# Altium schematic sheet 10ethernet100.SchDoc
size C
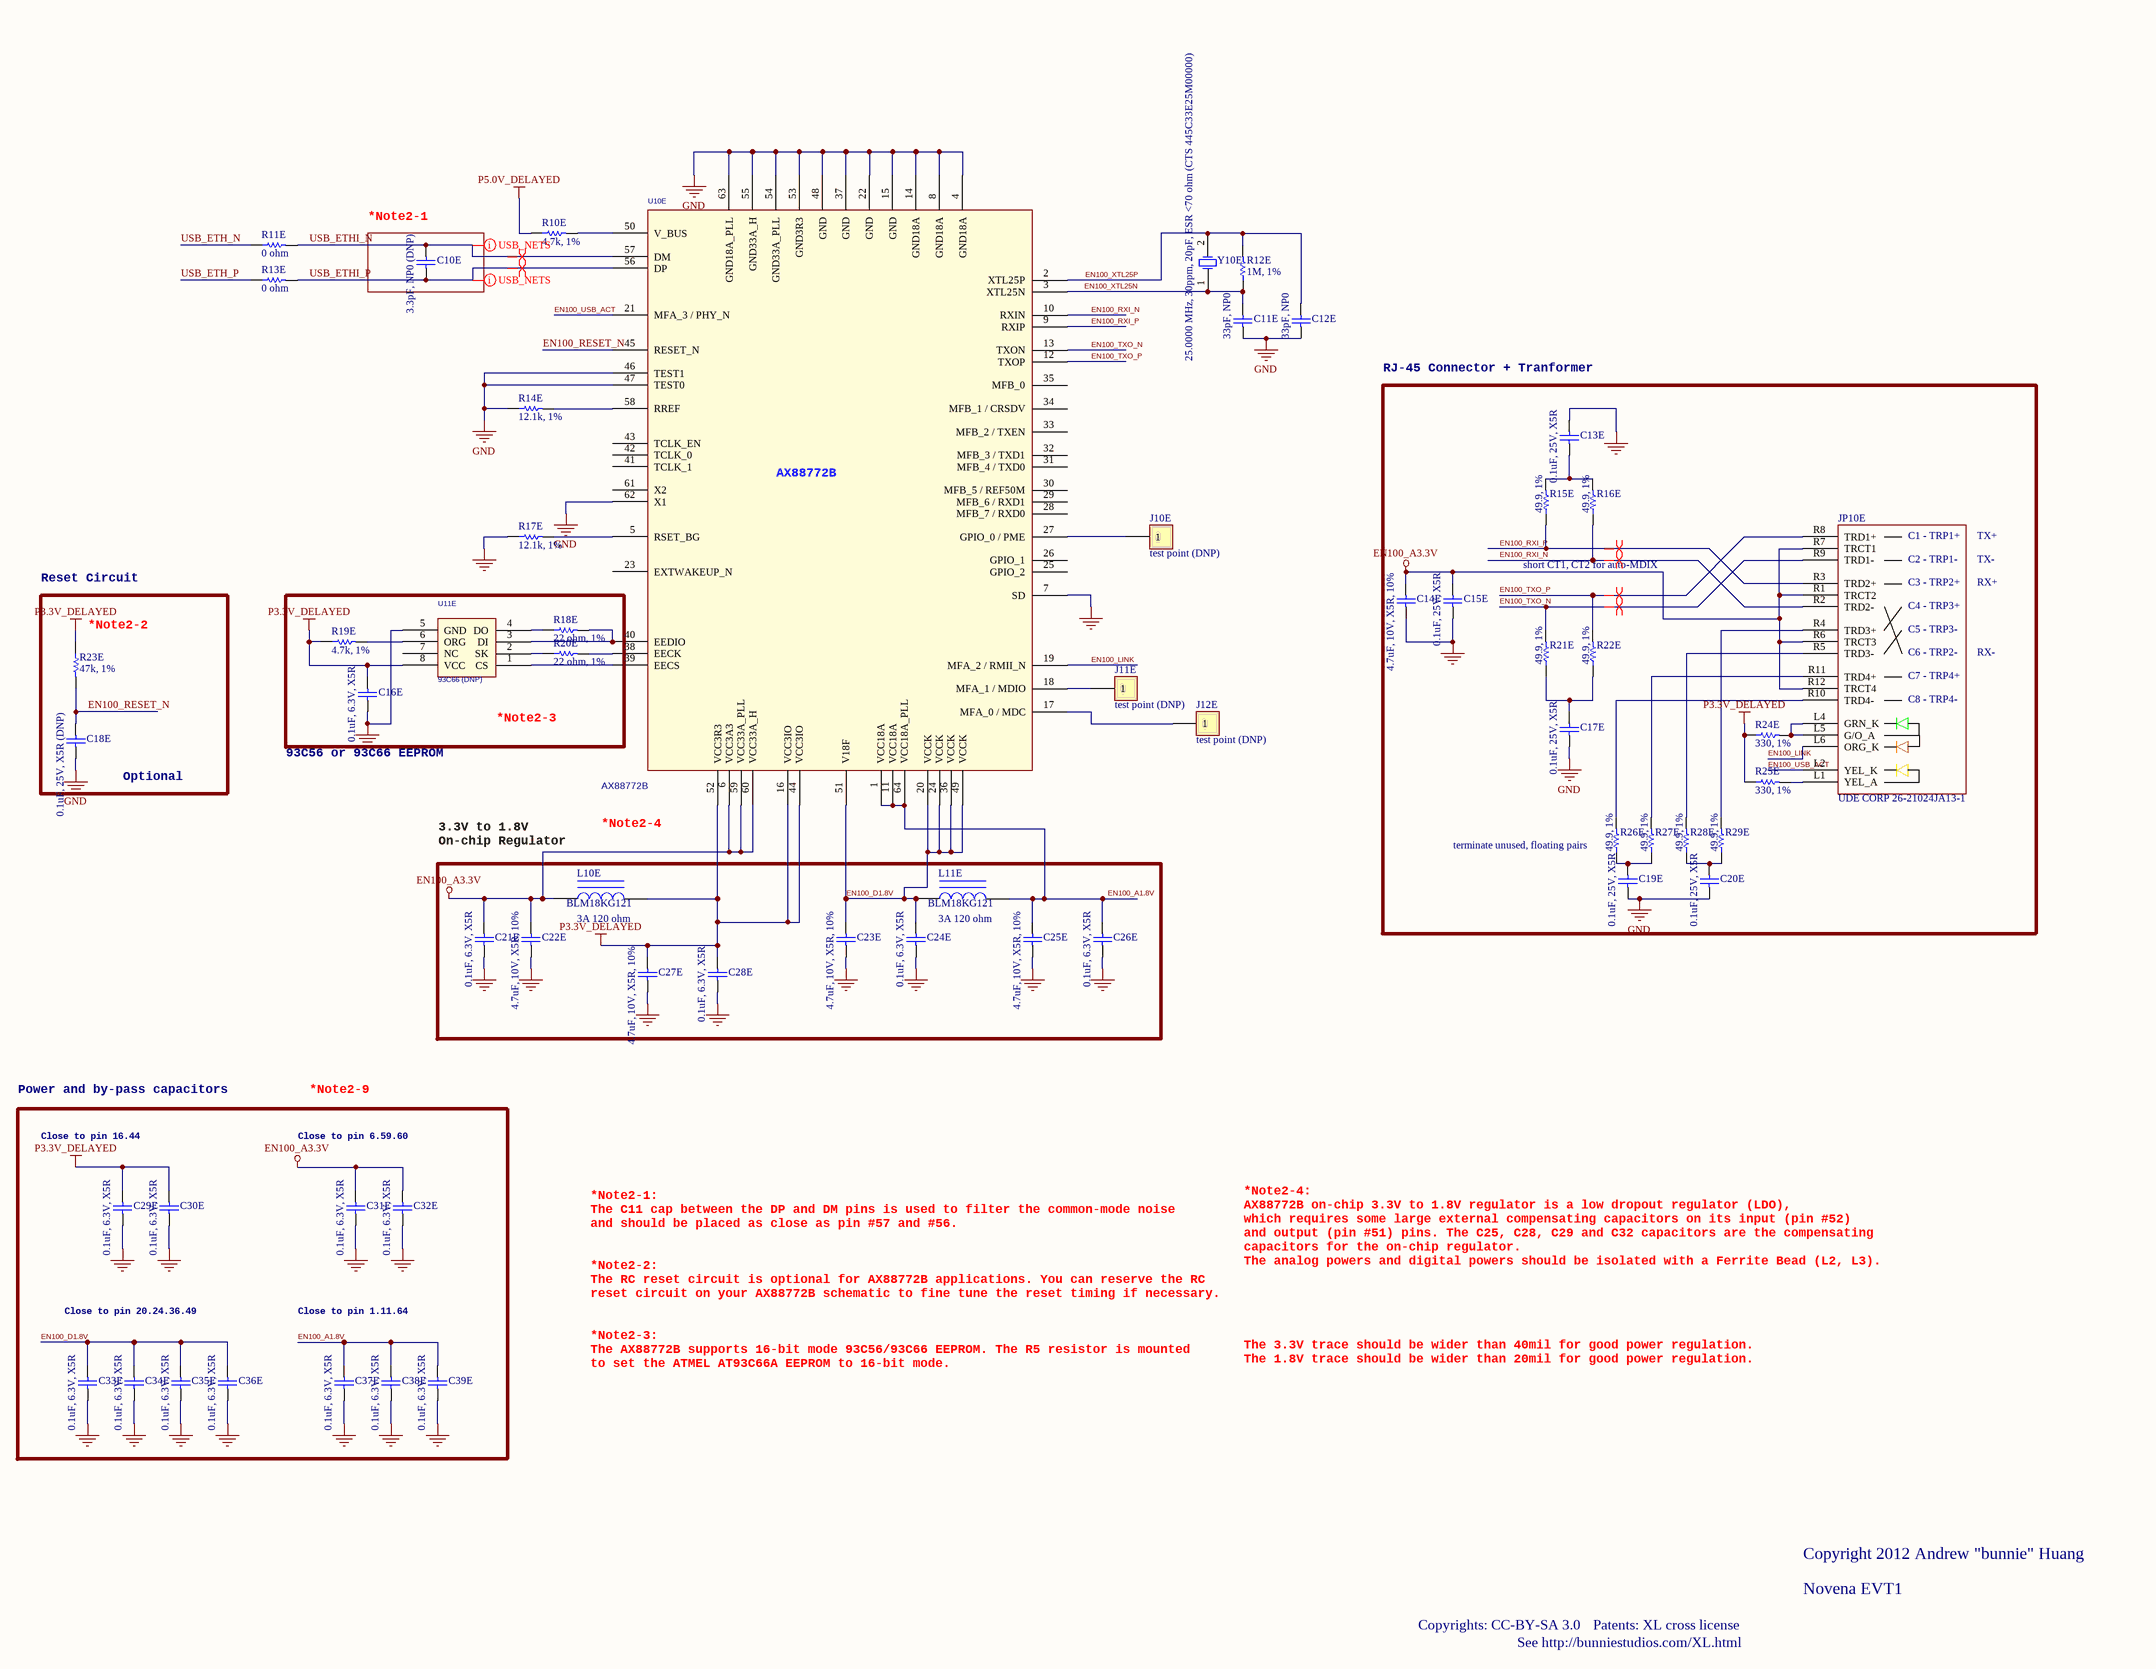
[diagram p0: 10ethernet100.SchDoc]

## Parts
C10E  3.3pF, NP0 (DNP)  [CAPC1005N]
C11E  33pF, NP0  [CAPC1005N]
C12E  33pF, NP0  [CAPC1005N]
C13E  0.1uF, 25V, X5R  [CAPC1005N]
C14E  4.7uF, 10V, X5R, 10%  [CAPC1608N]
C15E  0.1uF, 25V, X5R  [CAPC1005N]
C16E  0.1uF, 6.3V, X5R  [CAPC0603N_B]
C17E  0.1uF, 25V, X5R  [CAPC1005N]
C18E  0.1uF, 25V, X5R (DNP)  [CAPC1005N]
C19E  0.1uF, 25V, X5R  [CAPC1005N]
C20E  0.1uF, 25V, X5R  [CAPC1005N]
C21E  0.1uF, 6.3V, X5R  [CAPC0603N_B]
C22E  4.7uF, 10V, X5R, 10%  [CAPC1608N]
C23E  4.7uF, 10V, X5R, 10%  [CAPC1608N]
C24E  0.1uF, 6.3V, X5R  [CAPC0603N_B]
C25E  4.7uF, 10V, X5R, 10%  [CAPC1608N]
C26E  0.1uF, 6.3V, X5R  [CAPC0603N_B]
C27E  4.7uF, 10V, X5R, 10%  [CAPC1608N]
C28E  0.1uF, 6.3V, X5R  [CAPC0603N_B]
C29E  0.1uF, 6.3V, X5R  [CAPC0603N_B]
C30E  0.1uF, 6.3V, X5R  [CAPC0603N_B]
C31E  0.1uF, 6.3V, X5R  [CAPC0603N_B]
C32E  0.1uF, 6.3V, X5R  [CAPC0603N_B]
C33E  0.1uF, 6.3V, X5R  [CAPC0603N_B]
C34E  0.1uF, 6.3V, X5R  [CAPC0603N_B]
C35E  0.1uF, 6.3V, X5R  [CAPC0603N_B]
C36E  0.1uF, 6.3V, X5R  [CAPC0603N_B]
C37E  0.1uF, 6.3V, X5R  [CAPC0603N_B]
C38E  0.1uF, 6.3V, X5R  [CAPC0603N_B]
C39E  0.1uF, 6.3V, X5R  [CAPC0603N_B]
J10E  test point (DNP)  [TP_SMT_38mil]
J11E  test point (DNP)  [TP_SMT_38mil]
J12E  test point (DNP)  [TP_SMT_38mil]
JP10E  UDE CORP 26-21024JA13-1  [UDE_CORP_26-21024JA13-1]
L10E  BLM18KG121  value 3A 120 ohm  [INDC1608AN]
L11E  BLM18KG121  value 3A 120 ohm  [INDC1608AN]
R10E  4.7k, 1%  [RESC1005N]
R11E  0 ohm  [RESC1005N]
R12E  1M, 1%  [RESC1005N]
R13E  0 ohm  [RESC1005N]
R14E  12.1k, 1%  [RESC1005N]
R15E  49.9, 1%  [RESC1005N]
R16E  49.9, 1%  [RESC1005N]
R17E  12.1k, 1%  [RESC1005N]
R18E  22 ohm, 1%  [RESC1005N]
R19E  4.7k, 1%  [RESC1005N]
R20E  22 ohm, 1%  [RESC1005N]
R21E  49.9, 1%  [RESC1005N]
R22E  49.9, 1%  [RESC1005N]
R23E  47k, 1%  [RESC1005N]
R24E  330, 1%  [RESC1005N]
R25E  330, 1%  [RESC1005N]
R26E  49.9, 1%  [RESC1005N]
R27E  49.9, 1%  [RESC1005N]
R28E  49.9, 1%  [RESC1005N]
R29E  49.9, 1%  [RESC1005N]
U10E  AX88772B  [TSQFP40P900X900-64N]
U11E  93C66 (DNP)  [TSOP65P640-8AN]
Y10E  25.0000 MHz, 30ppm, 20pF, ESR <70 ohm (CTS 445C33E25M00000)  [NDK_NX5032A]

## Blocks framed on the sheet
*Note2-1: C10E
RJ-45 Connector + Tranformer: C13E C14E C15E C17E C19E C20E JP10E R15E R16E R21E R22E R24E R25E R26E R27E R28E R29E
*Note2-3: C16E R18E R19E R20E U11E

## Nets
EN100_A3.3V: C14E.1 C15E.1 C21E.1 C22E.1 C31E.1 C32E.1 JP10E.R1(TRCT2) JP10E.R6(TRCT3) JP10E.R7(TRCT1) JP10E.R12(TRCT4) L10E.1 U10E.6(VCC3A3) U10E.59(VCC33A_PLL) U10E.60(VCC33A_H)
GND: C11E.2 C12E.2 C13E.1 C14E.2 C15E.2 C16E.2 C17E.2 C18E.2 C19E.2 C20E.2 C21E.2 C22E.2 C23E.2 C24E.2 C25E.2 C26E.2 C27E.2 C28E.2 C29E.2 C30E.2 C31E.2 C32E.2 C33E.2 C34E.2 C35E.2 C36E.2 C37E.2 C38E.2 C39E.2 R14E.1 R17E.1 U10E.4(GND18A) U10E.7(SD) U10E.8(GND18A) U10E.14(GND18A) U10E.15(GND) U10E.22(GND) U10E.37(GND) U10E.46(TEST1) U10E.47(TEST0) U10E.48(GND) U10E.53(GND3R3) U10E.54(GND33A_PLL) U10E.55(GND33A_H) U10E.62(X1) U10E.63(GND18A_PLL) U11E.5(GND)
P3.3V_DELAYED: C16E.1 C27E.1 C28E.1 C29E.1 C30E.1 L10E.2 R19E.1 R23E.1 R24E.1 R25E.1 U10E.16(VCC3IO) U10E.44(VCC3IO) U10E.52(VCC3R3) U11E.8(VCC)
P5.0V_DELAYED: R10E.1
EN100_A1.8V: C25E.1 C26E.1 C37E.1 C38E.1 C39E.1 L11E.2 U10E.1(VCC18A) U10E.11(VCC18A) U10E.64(VCC18A_PLL)
EN100_D1.8V: C23E.1 C24E.1 C33E.1 C34E.1 C35E.1 C36E.1 L11E.1 U10E.20(VCCK) U10E.24(VCCK) U10E.36(VCCK) U10E.49(VCCK) U10E.51(V18F)
EN100_LINK: JP10E.L6(ORG_K) U10E.19(MFA_2_/_RMII_N)
EN100_RESET_N: C18E.1 R23E.2 U10E.45(RESET_N)
EN100_RXI_N: JP10E.R2(TRD2-) R16E.1 U10E.10(RXIN)
EN100_RXI_P: JP10E.R3(TRD2+) R15E.1 U10E.9(RXIP)
EN100_TXO_N: JP10E.R9(TRD1-) R21E.2 U10E.13(TXON)
EN100_TXO_P: JP10E.R8(TRD1+) R22E.2 U10E.12(TXOP)
EN100_USB_ACT: JP10E.L2(YEL_K) U10E.21(MFA_3_/_PHY_N)
EN100_XTL25N: C11E.1 R12E.1 U10E.3(XTL25N) Y10E.1(OSC1)
EN100_XTL25P: C12E.1 R12E.2 U10E.2(XTL25P) Y10E.2(OSC2)
USB_ETH_N: R11E.1
USB_ETH_P: R13E.1
USB_ETHI_N: C10E.1 R11E.2 U10E.57(DM)
USB_ETHI_P: C10E.2 R13E.2 U10E.56(DP)
NetC13E_2: C13E.2 R15E.2 R16E.2
NetC17E_1: C17E.1 R21E.1 R22E.1
NetC19E_1: C19E.1 R26E.1 R27E.1
NetC20E_1: C20E.1 R28E.1 R29E.1
NetJ10E_1: J10E.1 U10E.27(GPIO_0_/_PME)
NetJ11E_1: J11E.1 U10E.18(MFA_1_/_MDIO)
NetJ12E_1: J12E.1 U10E.17(MFA_0_/_MDC)
NetJP10E_L1: JP10E.L1(YEL_A) R25E.2
NetJP10E_L4: JP10E.L4(GRN_K) JP10E.L5(G/O_A) R24E.2
NetJP10E_R4: JP10E.R4(TRD3+) R29E.2
NetJP10E_R5: JP10E.R5(TRD3-) R28E.2
NetJP10E_R10: JP10E.R10(TRD4-) R26E.2
NetJP10E_R11: JP10E.R11(TRD4+) R27E.2
NetR10E_2: R10E.2 U10E.50(V_BUS)
NetR14E_2: R14E.2 U10E.58(RREF)
NetR17E_2: R17E.2 U10E.5(RSET_BG)
NetR18E_1: R18E.1 U11E.4(DO)
NetR18E_2: R18E.2 U10E.40(EEDIO) U11E.3(DI)
NetR19E_2: R19E.2 U11E.6(ORG)
NetR20E_1: R20E.1 U11E.2(SK)
NetR20E_2: R20E.2 U10E.38(EECK)
NetU10E_39: U10E.39(EECS) U11E.1(CS)

Not connected (* = marked no-connect by the designer): U10E 23(EXTWAKEUP_N) 25(GPIO_2) 26(GPIO_1) 28(MFB_7_/_RXD0) 29(MFB_6_/_RXD1) 30(MFB_5_/_REF50M) 31(MFB_4_/_TXD0) 32(MFB_3_/_TXD1) 33(MFB_2_/_TXEN) 34(MFB_1_/_CRSDV) 35(MFB_0) 41(TCLK_1) 42(TCLK_0) 43(TCLK_EN) 61(X2); U11E 7(NC)

## Layout directives
differential pair: EN100_RXI_N, EN100_RXI_P, EN100_TXO_N, EN100_TXO_P, USB_ETHI_N, USB_ETHI_P
net class USB_NETS: USB_ETHI_N, USB_ETHI_P

## Notes on the sheet
- TX+
- Reset Circuit
- short CT1, CT2 for auto-MDIX
- RX+
- TX-
- (near R23E) *Note2-2
- RX-
- Optional
- 93C56 or 93C66 EEPROM
- *Note2-4
- 3.3V to 1.8V
  On-chip Regulator
- (near R26E) terminate unused, floating pairs
- Power and by-pass capacitors
- *Note2-9
- Close to pin 16.44
- Close to pin 6.59.60
- *Note2-1:
  The C11 cap between the DP and DM pins is used to filter the common-mode noise
  and should be placed as close as pin #57 and #56.
- *Note2-4:
  AX88772B on-chip 3.3V to 1.8V regulator is a low dropout regulator (LDO),
  which requires some large external compensating capacitors on its input (pin #52)
  and output (pin #51) pins. The C25, C28, C29 and C32 capacitors are the compensating
  capacitors for the on-chip regulator.
  The analog powers and digital powers should be isolated with a Ferrite Bead (L2, L3).
- Close to pin 20.24.36.49
- Close to pin 1.11.64
- *Note2-2:
  The RC reset circuit is optional for AX88772B applications. You can reserve the RC
  reset circuit on your AX88772B schematic to fine tune the reset timing if necessary.
- *Note2-3:
  The AX88772B supports 16-bit mode 93C56/93C66 EEPROM. The R5 resistor is mounted
  to set the ATMEL AT93C66A EEPROM to 16-bit mode.
- The 3.3V trace should be wider than 40mil for good power regulation.
  The 1.8V trace should be wider than 20mil for good power regulation.
- Copyright 2012 Andrew "bunnie" Huang
- Novena EVT1
- Copyrights: CC-BY-SA 3.0
- See http://bunniestudios.com/XL.html
- Patents: XL cross license
- (in symbol UDE_CORP_26-21024JA13-1) C1 - TRP1+; C2 - TRP1-; C3 - TRP2+; C4 - TRP3+; C5 - TRP3-; C6 - TRP2-; C7 - TRP4+; C8 - TRP4-

## Library data of the parts
C10E C11E C12E C13E C14E C15E C16E C17E C18E C19E C20E C21E C22E C23E C24E C25E C26E C27E C28E C29E C30E C31E C32E C33E C34E C35E C36E C37E C38E C39E = Cap Semi: Capacitor (Semiconductor SIM Model); Published: 8-Jun-2000; LatestRevisionDate: 17-Jul-2002; LatestRevisionNote: Re-released for DXP Platform.; PackageReference: C1206; Publisher: Altium Limited
J10E J11E J12E = CON1: Connector
JP10E = UDE_CORP_26-21024JA13-1: 10/100/1000BT + magnetics, symmetric, tab up, with LEDs
L10E L11E = Inductor Iron: Magnetic-Core Inductor; Published: 24-Mar-1999; LatestRevisionDate: 17-Jul-2002; LatestRevisionNote: Re-released for DXP Platform.; PackageReference: AXIAL-0.9; Publisher: Altium Limited
R10E R11E R12E R13E R14E R15E R16E R17E R18E R19E R20E R21E R22E R23E R24E R25E R26E R27E R28E R29E = Res1: Resistor; Value: 100k; Published: 8-Jun-2000; LatestRevisionDate: 17-Jul-2002; LatestRevisionNote: Re-released for DXP Platform.; PackageReference: AXIAL-0.3; Publisher: Altium Limited
U10E = AX88772B_28
U11E = 93c66_0
Y10E = XTAL: Crystal Oscillator; Published: 8-Jun-2000; LatestRevisionDate: 17-Jul-2002; LatestRevisionNote: Re-released for DXP Platform.; PackageReference: R38; Publisher: Altium Limited